# EAGLE design camera_board (EAGLE 5.10)
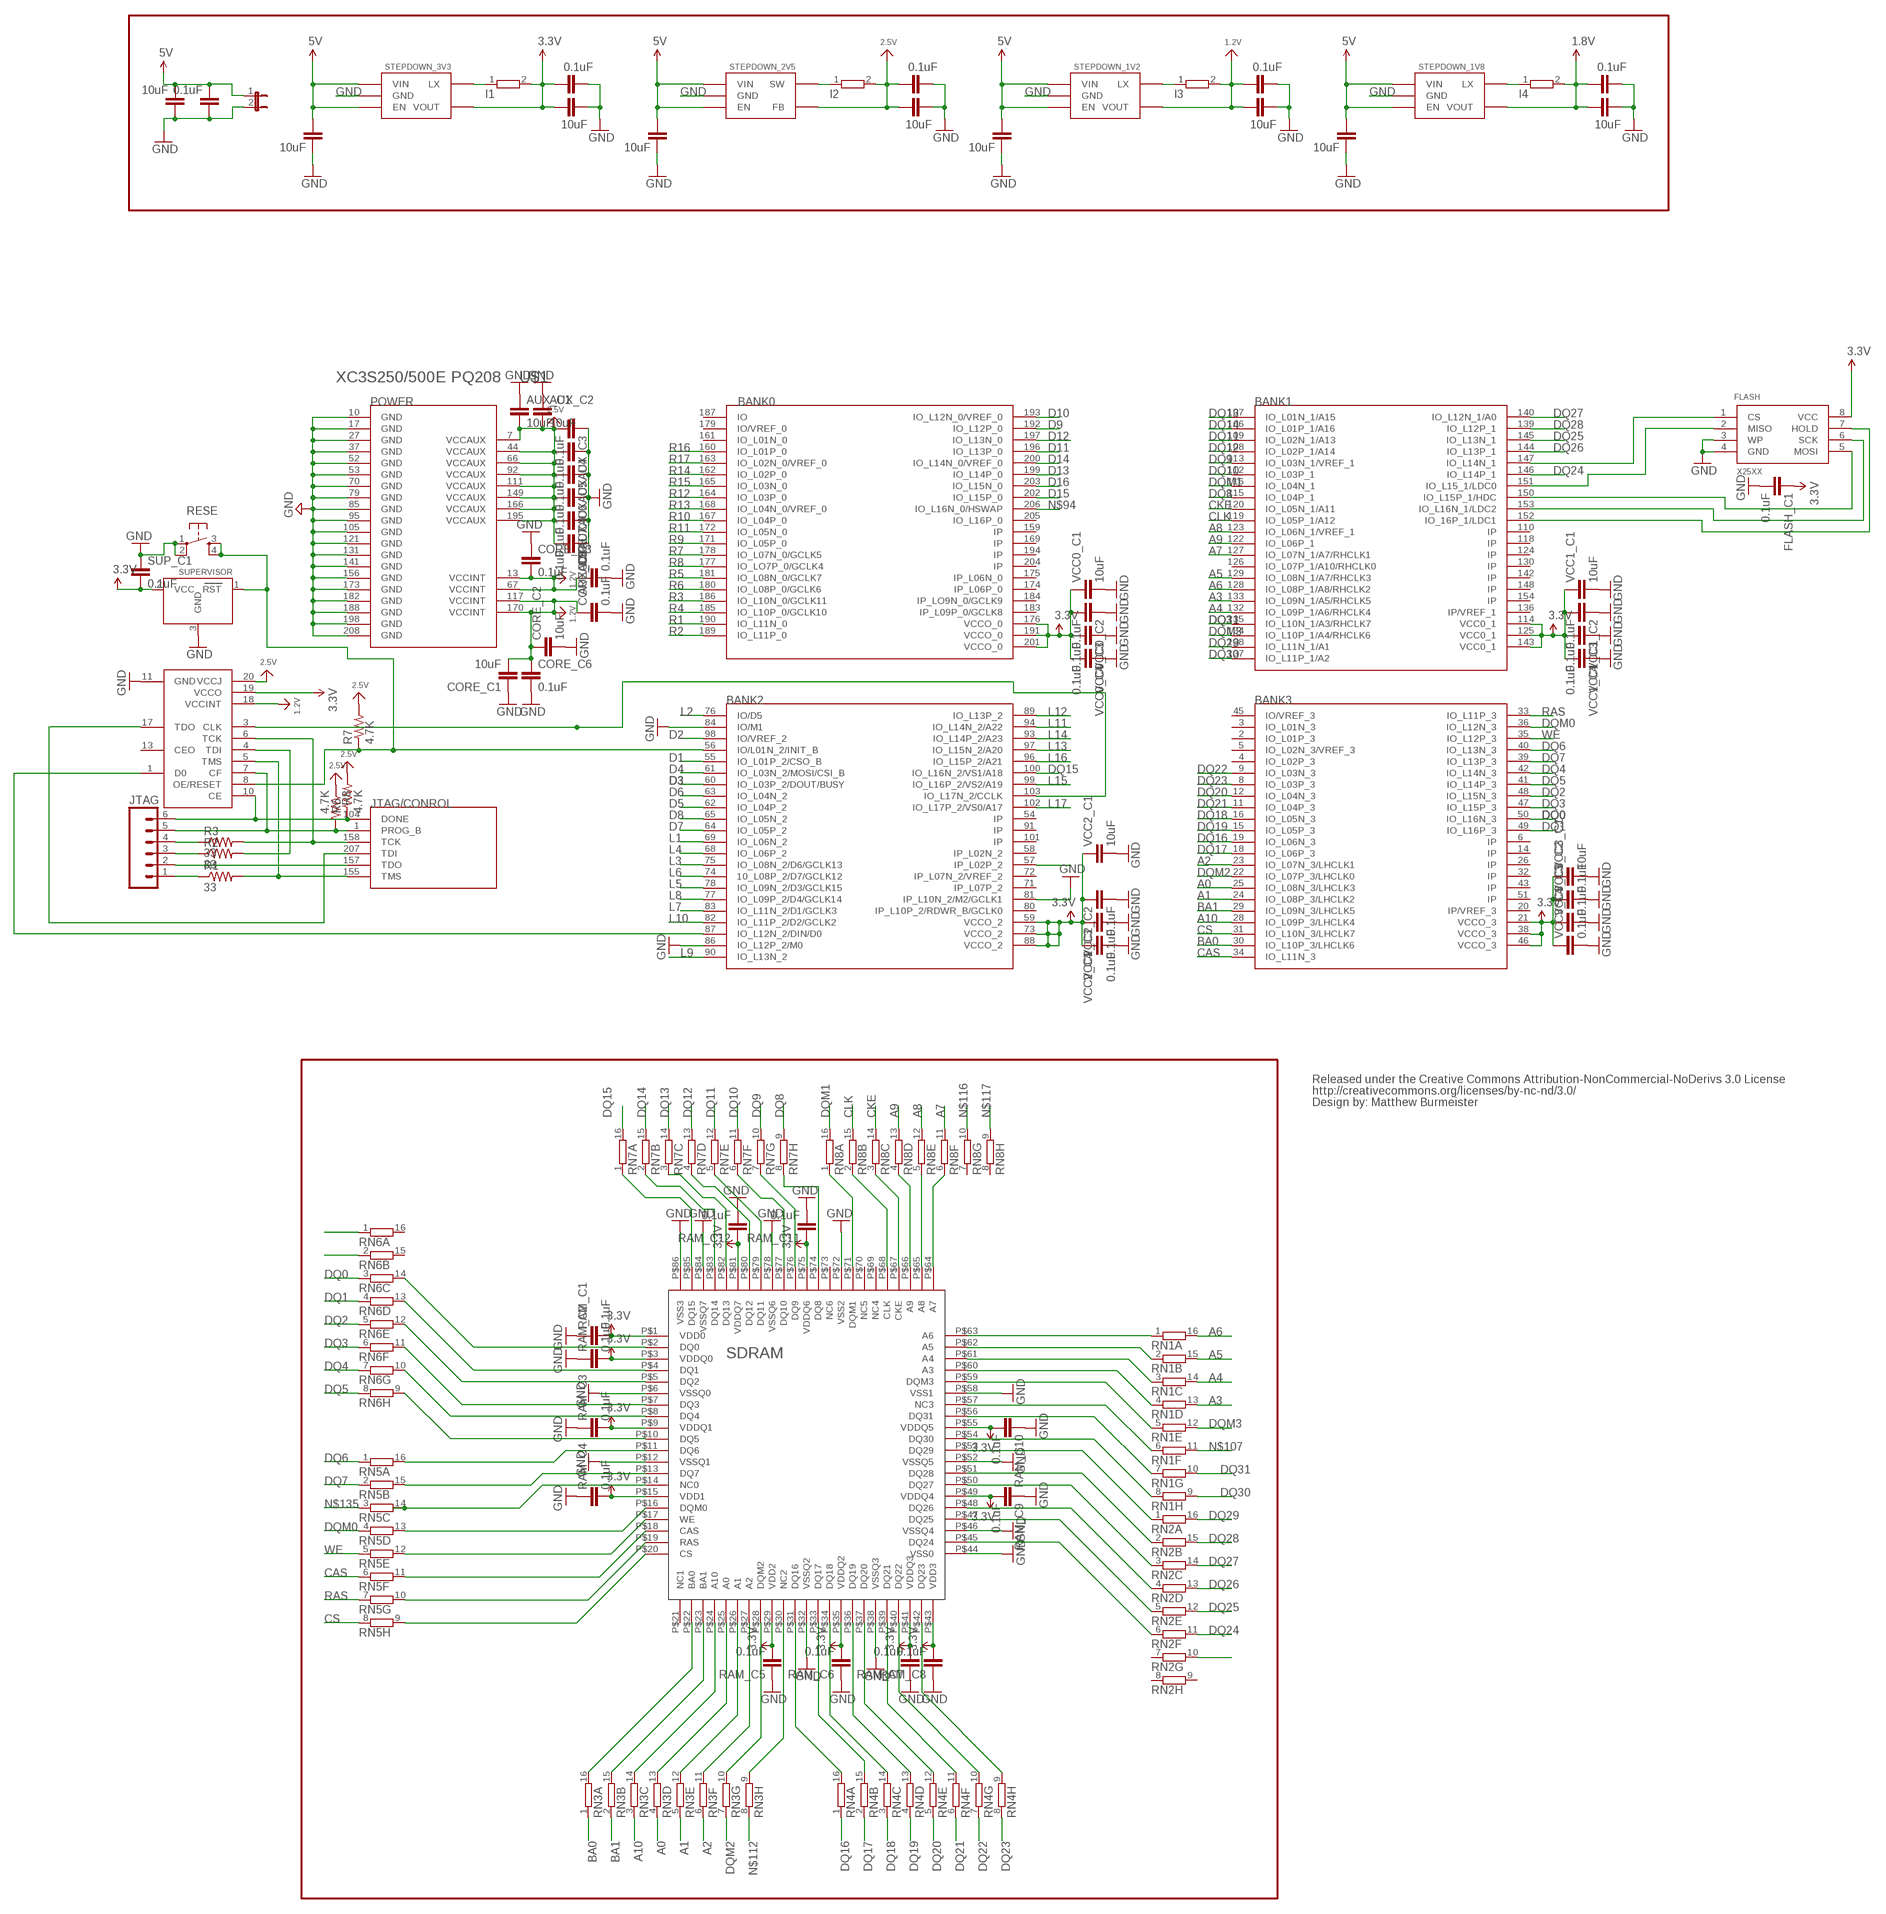
[diagram p0: schematic, sheet 1, part 1 of 2]
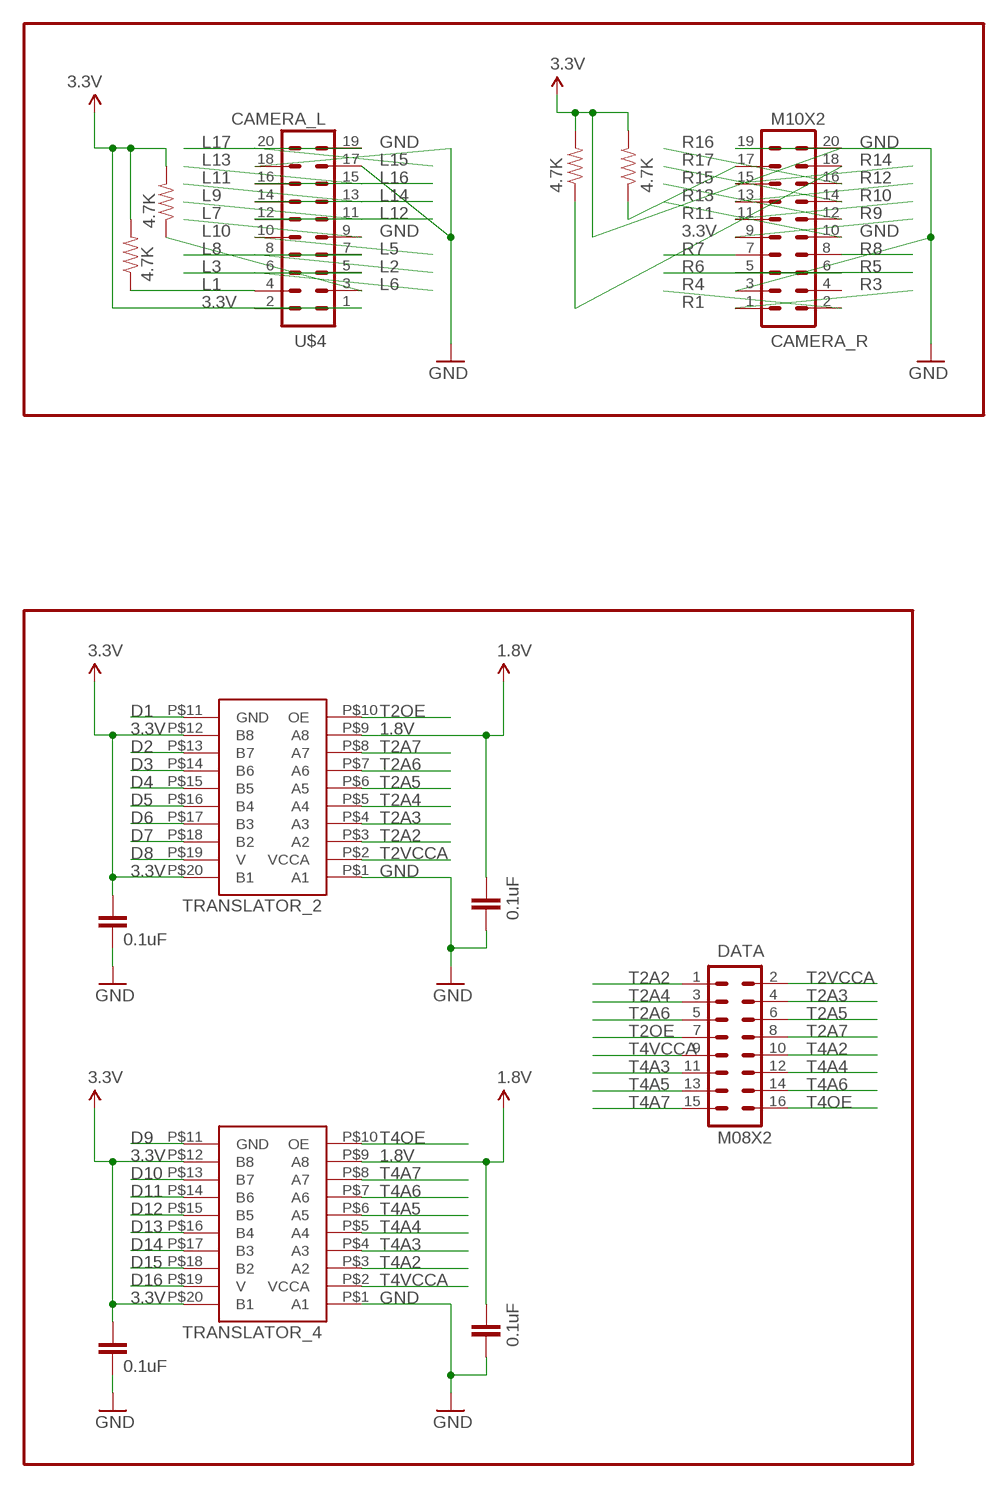
[diagram p1: schematic, sheet 1, part 2 of 2]

## Parts
1V2_C1  10uF  CAP0805  [0805]
1V2_C2  0.1uF  CAP0805  [0805]
1V2_C3  10uF  CAP0805  [0805]
1V8_C1  10uF  CAP0805  [0805]
1V8_C2  0.1uF  CAP0805  [0805]
1V8_C3  10uF  CAP0805  [0805]
2V5_C1  10uF  CAP0805  [0805]
2V5_C2  0.1uF  CAP0805  [0805]
2V5_C3  10uF  CAP0805  [0805]
3V3_C1  10uF  CAP0805  [0805]
3V3_C2  0.1uF  CAP0805  [0805]
3V3_C3  10uF  CAP0805  [0805]
5V  JP1E  [JP1]
5V_C1  10uF  CAP0805  [0805]
5V_C2  0.1uF  CAP0805  [0805]
AUX_C1  10uF  CAP1206  [1206]
AUX_C2  10uF  CAP1206  [1206]
AUX_C3  0.1uF  CAP0805  [0805]
AUX_C4  0.1uF  CAP0805  [0805]
AUX_C5  0.1uF  CAP0805  [0805]
AUX_C6  0.1uF  CAP0805  [0805]
AUX_C7  0.1uF  CAP0805  [0805]
AUX_C8  0.1uF  CAP0805  [0805]
CAMERA_R  M10X2  [2X10]
CORE_C1  10uF  CAP1206  [1206]
CORE_C2  10uF  CAP1206  [1206]
CORE_C3  0.1uF  CAP0805  [0805]
CORE_C4  0.1uF  CAP0805  [0805]
CORE_C5  0.1uF  CAP0805  [0805]
CORE_C6  0.1uF  CAP0805  [0805]
DATA  M08X2  [2X8]
FLASH  X25XX  SPI_FLASH-X25XXSMD1  [SO08-EIAJ]
FLASH_C1  0.1uF  CAP0805  [0805]
I1  AVC_CRI1008  [1008-2]
I2  AVC_CRI1008  [1008-2]
I3  AVC_CRI1008  [1008-2]
I4  AVC_CRI1008  [1008-2]
INFO1  CC_MATTTHEGEEKAVC  [CC_MATTTHEGEEK]
JTAG  M06SIP  [1X06]
PROM  XCF02STSSOP  [TSSOP20]
R1  33  RESISTOR0402-RES  [0402-RES]
R2  33  RESISTOR0402-RES  [0402-RES]
R3  33  RESISTOR0402-RES  [0402-RES]
R6  4.7K  RESISTOR0402-RES  [0402-RES]
R7  4.7K  RESISTOR0402-RES  [0402-RES]
R8  4.7K  RESISTOR0402-RES  [0402-RES]
R9  4.7K  RESISTOR0402-RES  [0402-RES]
R10  4.7K  RESISTOR0402-RES  [0402-RES]
R11  4.7K  RESISTOR0402-RES  [0402-RES]
R12  4.7K  RESISTOR0402-RES  [0402-RES]
RAM_C1  0.1uF  CAP0805  [0805]
RAM_C2  0.1uF  CAP0805  [0805]
RAM_C3  0.1uF  CAP0805  [0805]
RAM_C4  0.1uF  CAP0805  [0805]
RAM_C5  0.1uF  CAP0805  [0805]
RAM_C6  0.1uF  CAP0805  [0805]
RAM_C7  0.1uF  CAP0805  [0805]
RAM_C8  0.1uF  CAP0805  [0805]
RAM_C9  0.1uF  CAP0805  [0805]
RAM_C10  0.1uF  CAP0805  [0805]
RAM_C11  0.1uF  CAP0805  [0805]
RAM_C12  0.1uF  CAP0805  [0805]
RESE  TAC_SWITCHSMD  [TACTILE_SWITCH_SMD]
RN1  AVC_8R-NEXB2HV  [EXB2HV]
RN2  AVC_8R-NEXB2HV  [EXB2HV]
RN3  AVC_8R-NEXB2HV  [EXB2HV]
RN4  AVC_8R-NEXB2HV  [EXB2HV]
RN5  AVC_8R-NEXB2HV  [EXB2HV]
RN6  AVC_8R-NEXB2HV  [EXB2HV]
RN7  AVC_8R-NEXB2HV  [EXB2HV]
RN8  AVC_8R-NEXB2HV  [EXB2HV]
SDRAM  AVC_512KSDRAM  [TSOPII86]
STEPDOWN_1V2  AVC_HIGHPOWERREGSOT  [SOT23-5]
STEPDOWN_1V8  AVC_HIGHPOWERREGSOT  [SOT23-5]
STEPDOWN_2V5  AVC_LOWPOWERREGSOT  [SOT23-5]
STEPDOWN_3V3  AVC_HIGHPOWERREGSOT  [SOT23-5]
SUP_C1  0.1uF  CAP0805  [0805]
SUPERVISOR  MCP130TWAVE  [SOT23-W]
TRANS_C1  0.1uF  CAP0805  [0805]
TRANS_C2  0.1uF  CAP0805  [0805]
TRANS_C4  0.1uF  CAP0805  [0805]
TRANSC3  0.1uF  CAP0805  [0805]
TRANSLATOR_2  AVC_BITRANSLATORTSSOP  [TSSOP20]
TRANSLATOR_4  AVC_BITRANSLATORTSSOP  [TSSOP20]
U$1  XC3S250/500E-PQ208  [PQ208]
U$4  CAMERA_L  M10X2  [2X10]
VCC0_C1  10uF  CAP1206  [1206]
VCC0_C2  0.1uF  CAP0805  [0805]
VCC0_C3  0.1uF  CAP0805  [0805]
VCC0_C4  0.1uF  CAP0805  [0805]
VCC1_C1  10uF  CAP1206  [1206]
VCC1_C2  0.1uF  CAP0805  [0805]
VCC1_C3  0.1uF  CAP0805  [0805]
VCC1_C4  0.1uF  CAP0805  [0805]
VCC2_C1  10uF  CAP1206  [1206]
VCC2_C2  0.1uF  CAP0805  [0805]
VCC2_C3  0.1uF  CAP0805  [0805]
VCC2_C4  0.1uF  CAP0805  [0805]
VCC3_C1  10uF  CAP1206  [1206]
VCC3_C2  0.1uF  CAP0805  [0805]
VCC3_C3  0.1uF  CAP0805  [0805]
VCC3_C4  0.1uF  CAP0805  [0805]

## Nets
1.2V: 1V2_C2.2 1V2_C3.1 CORE_C1.2 CORE_C2.1 CORE_C3.2 CORE_C4.1 CORE_C5.1 CORE_C6.1 I3.2 PROM.18(VCCINT) STEPDOWN_1V2.4(VOUT) U$1.13(VCCINT) U$1.67(VCCINT) U$1.117(VCCINT) U$1.170(VCCINT)
1.8V: 1V8_C2.2 1V8_C3.1 I4.2 STEPDOWN_1V8.4(VOUT) TRANS_C2.1 TRANS_C4.1 TRANSLATOR_2.P$9(A8) TRANSLATOR_4.P$9(A8)
2.5V: 2V5_C2.2 2V5_C3.1 AUX_C1.2 AUX_C2.2 AUX_C3.2 AUX_C4.2 AUX_C5.2 AUX_C6.2 AUX_C7.2 AUX_C8.2 I2.2 PROM.20(VCCJ) R6.2 R7.2 R8.1 STEPDOWN_2V5.4(FB) U$1.7(VCCAUX) U$1.44(VCCAUX) U$1.66(VCCAUX) U$1.92(VCCAUX) U$1.111(VCCAUX) U$1.149(VCCAUX) U$1.166(VCCAUX) U$1.195(VCCAUX)
3.3V: 3V3_C2.2 3V3_C3.1 CAMERA_R.20 FLASH.8(VCC) FLASH_C1.1 I1.2 PROM.19(VCCO) R9.2 R10.2 R11.2 R12.2 RAM_C1.2 RAM_C2.2 RAM_C3.2 RAM_C4.2 RAM_C5.2 RAM_C6.2 RAM_C7.2 RAM_C8.2 RAM_C9.2 RAM_C10.2 RAM_C11.1 RAM_C12.1 SDRAM.P$1(VDD0) SDRAM.P$3(VDDQ0) SDRAM.P$9(VDDQ1) SDRAM.P$15(VDD1) SDRAM.P$29(VDD2) SDRAM.P$35(VDDQ2) SDRAM.P$41(VDDQ3) SDRAM.P$43(VDD3) SDRAM.P$49(VDDQ4) SDRAM.P$55(VDDQ5) SDRAM.P$75(VDDQ6) SDRAM.P$81(VDDQ7) STEPDOWN_3V3.4(VOUT) SUP_C1.2 SUPERVISOR.2(VCC) TRANS_C1.1 TRANSC3.1 TRANSLATOR_2.P$12(B8) TRANSLATOR_2.P$20(B1) TRANSLATOR_4.P$12(B8) TRANSLATOR_4.P$20(B1) U$1.21(VCCO_3) U$1.38(VCCO_3) U$1.46(VCCO_3) U$1.59(VCCO_2) U$1.73(VCCO_2) U$1.88(VCCO_2) U$1.114(VCC0_1) U$1.125(VCC0_1) U$1.143(VCC0_1) U$1.176(VCCO_0) U$1.191(VCCO_0) U$1.201(VCCO_0) U$4.1 VCC0_C1.1 VCC0_C2.2 VCC0_C3.2 VCC0_C4.2 VCC1_C1.1 VCC1_C2.2 VCC1_C3.2 VCC1_C4.2 VCC2_C1.1 VCC2_C2.1 VCC2_C3.1 VCC2_C4.1 VCC3_C1.1 VCC3_C2.1 VCC3_C3.1 VCC3_C4.1
5V: 1V2_C1.2 1V8_C1.2 2V5_C1.2 3V3_C1.2 5V.1 5V_C1.2 5V_C2.2 STEPDOWN_1V2.1(VIN) STEPDOWN_1V2.3(EN) STEPDOWN_1V8.1(VIN) STEPDOWN_1V8.3(EN) STEPDOWN_2V5.1(VIN) STEPDOWN_2V5.3(EN) STEPDOWN_3V3.1(VIN) STEPDOWN_3V3.3(EN)
A0: RN3.4 U$1.25(IO_L08N_3/LHCLK3)
A1: RN3.5 U$1.24(IO_L08P_3/LHCLK2)
A2: RN3.6 U$1.23(IO_L07N_3/LHCLK1)
A3: RN1.13 U$1.133(IO_L09N_1/A5/RHCLK5)
A4: RN1.14 U$1.132(IO_L09P_1/A6/RHCLK4)
A5: RN1.15 U$1.129(IO_L08N_1/A7/RHCLK3)
A6: RN1.16 U$1.128(IO_L08P_1/A8/RHCLK2)
A7: RN8.11 U$1.127(IO_L07N_1/A7/RHCLK1)
A8: RN8.12 U$1.123(IO_L06N_1/VREF_1)
A9: RN8.13 U$1.122(IO_L06P_1)
A10: RN3.3 U$1.28(IO_L09P_3/LHCLK4)
BA0: RN3.1 U$1.30(IO_L10P_3/LHCLK6)
BA1: RN3.2 U$1.29(IO_L09N_3/LHCLK5)
CAS: RN5.6 U$1.34(IO_L11N_3)
CKE: RN8.14 U$1.120(IO_L05N_1/A11)
CLK: RN8.15 U$1.119(IO_L05P_1/A12)
CS: RN5.8 U$1.31(IO_L10N_3/LHCLK7)
D1: TRANSLATOR_2.P$11(GND) U$1.55(IO_L01P_2/CSO_B)
D2: TRANSLATOR_2.P$13(B7) U$1.98(IO/VREF_2)
D3: TRANSLATOR_2.P$14(B6) U$1.60(IO_L03P_2/DOUT/BUSY)
D4: TRANSLATOR_2.P$15(B5) U$1.61(IO_L03N_2/MOSI/CSI_B)
D5: TRANSLATOR_2.P$16(B4) U$1.62(IO_L04P_2)
D6: TRANSLATOR_2.P$17(B3) U$1.63(IO_L04N_2)
D7: TRANSLATOR_2.P$18(B2) U$1.64(IO_L05P_2)
D8: TRANSLATOR_2.P$19(V) U$1.65(IO_L05N_2)
D9: TRANSLATOR_4.P$11(GND) U$1.192(IO_L12P_0)
D10: TRANSLATOR_4.P$13(B7) U$1.193(IO_L12N_0/VREF_0)
D11: TRANSLATOR_4.P$14(B6) U$1.196(IO_L13P_0)
D12: TRANSLATOR_4.P$15(B5) U$1.197(IO_L13N_0)
D13: TRANSLATOR_4.P$16(B4) U$1.199(IO_L14P_0)
D14: TRANSLATOR_4.P$17(B3) U$1.200(IO_L14N_0/VREF_0)
D15: TRANSLATOR_4.P$18(B2) U$1.202(IO_L15P_0)
D16: TRANSLATOR_4.P$19(V) U$1.203(IO_L15N_0)
DQ0: RN6.3 U$1.50(IO_L16N_3)
DQ1: RN6.4 U$1.49(IO_L16P_3)
DQ2: RN6.5 U$1.48(IO_L15N_3)
DQ3: RN6.6 U$1.47(IO_L15P_3)
DQ4: RN6.7 U$1.42(IO_L14N_3)
DQ5: RN6.8 U$1.41(IO_L14P_3)
DQ6: RN5.1 U$1.40(IO_L13N_3)
DQ7: RN5.2 U$1.39(IO_L13P_3)
DQ8: RN7.9 U$1.115(IO_L04P_1)
DQ9: RN7.10 U$1.113(IO_L03N_1/VREF_1)
DQ10: RN7.11 U$1.112(IO_L03P_1)
DQ11: RN7.12 U$1.109(IO_L02N_1/A13)
DQ12: RN7.13 U$1.108(IO_L02P_1/A14)
DQ13: RN7.14 U$1.107(IO_L01N_1/A15)
DQ14: RN7.15 U$1.106(IO_L01P_1/A16)
DQ15: RN7.16 U$1.100(IO_L16N_2/VS1/A18)
DQ16: RN4.1 U$1.19(IO_L06N_3)
DQ17: RN4.2 U$1.18(IO_L06P_3)
DQ18: RN4.3 U$1.16(IO_L05N_3)
DQ19: RN4.4 U$1.15(IO_L05P_3)
DQ20: RN4.5 U$1.12(IO_L04N_3)
DQ21: RN4.6 U$1.11(IO_L04P_3)
DQ22: RN4.7 U$1.9(IO_L03N_3)
DQ23: RN4.8 U$1.8(IO_L03P_3)
DQ24: RN2.11 U$1.146(IO_L14P_1)
DQ25: RN2.12 U$1.145(IO_L13N_1)
DQ26: RN2.13 U$1.144(IO_L13P_1)
DQ27: RN2.14 U$1.140(IO_L12N_1/A0)
DQ28: RN2.15 U$1.139(IO_L12P_1)
DQ29: RN2.16 U$1.138(IO_L11N_1/A1)
DQ30: RN1.9 U$1.137(IO_L11P_1/A2)
DQ31: RN1.10 U$1.135(IO_L10N_1/A3/RHCLK7)
DQM0: RN5.4 U$1.36(IO_L12N_3)
DQM1: RN8.16 U$1.116(IO_L04N_1)
DQM2: RN3.7 U$1.22(IO_L07P_3/LHCLK0)
DQM3: RN1.12 U$1.134(IO_L10P_1/A4/RHCLK6)
GND: 1V2_C1.1 1V2_C2.1 1V2_C3.2 1V8_C1.1 1V8_C2.1 1V8_C3.2 2V5_C1.1 2V5_C2.1 2V5_C3.2 3V3_C1.1 3V3_C2.1 3V3_C3.2 5V.2 5V_C1.1 5V_C2.1 AUX_C1.1 AUX_C2.1 AUX_C3.1 AUX_C4.1 AUX_C5.1 AUX_C6.1 AUX_C7.1 AUX_C8.1 CAMERA_R.3 CAMERA_R.19 CORE_C1.1 CORE_C2.2 CORE_C3.1 CORE_C4.2 CORE_C5.2 CORE_C6.2 FLASH.3(WP) FLASH.4(GND) FLASH_C1.2 PROM.11(GND) RAM_C1.1 RAM_C2.1 RAM_C3.1 RAM_C4.1 RAM_C5.1 RAM_C6.1 RAM_C7.1 RAM_C8.1 RAM_C9.1 RAM_C10.1 RAM_C11.2 RAM_C12.2 RESE.1 RESE.2 SDRAM.P$6(VSSQ0) SDRAM.P$12(VSSQ1) SDRAM.P$32(VSSQ2) SDRAM.P$38(VSSQ3) SDRAM.P$44(VSS0) SDRAM.P$46(VSSQ4) SDRAM.P$52(VSSQ5) SDRAM.P$58(VSS1) SDRAM.P$72(VSS2) SDRAM.P$78(VSSQ6) SDRAM.P$84(VSSQ7) SDRAM.P$86(VSS3) STEPDOWN_1V2.2(GND) STEPDOWN_1V8.2(GND) STEPDOWN_2V5.2(GND) STEPDOWN_3V3.2(GND) SUP_C1.1 SUPERVISOR.3(GND) TRANS_C1.2 TRANS_C2.2 TRANS_C4.2 TRANSC3.2 TRANSLATOR_2.P$1(A1) TRANSLATOR_4.P$1(A1) U$1.10(GND) U$1.17(GND) U$1.27(GND) U$1.37(GND) U$1.52(GND) U$1.53(GND) U$1.70(GND) U$1.79(GND) U$1.81(IP_L10N_2/M2/GCLK1) U$1.84(IO/M1) U$1.85(GND) U$1.86(IO_L12P_2/M0) U$1.95(GND) U$1.105(GND) U$1.121(GND) U$1.131(GND) U$1.141(GND) U$1.156(GND) U$1.173(GND) U$1.182(GND) U$1.188(GND) U$1.198(GND) U$1.208(GND) U$4.17 U$4.18 VCC0_C1.2 VCC0_C2.1 VCC0_C3.1 VCC0_C4.1 VCC1_C1.2 VCC1_C2.1 VCC1_C3.1 VCC1_C4.1 VCC2_C1.2 VCC2_C2.2 VCC2_C3.2 VCC2_C4.2 VCC3_C1.2 VCC3_C2.2 VCC3_C3.2 VCC3_C4.2
L1: R9.1 U$1.69(IO_L06N_2) U$4.4
L2: U$1.76(IO/D5) U$4.8
L3: U$1.75(IO_L08N_2/D6/GCLK13) U$4.5
L4: U$1.68(IO_L06P_2)
L5: U$1.78(IO_L09N_2/D3/GCLK15) U$4.10
L6: U$1.74(10_L08P_2/D7/GCLK12) U$4.6
L7: U$1.83(IO_L11N_2/D1/GCLK3) U$4.9
L8: U$1.77(IO_L09P_2/D4/GCLK14) U$4.7
L9: U$1.90(IO_L13N_2) U$4.11
L10: R10.1 U$1.82(IO_L11P_2/D2/GCLK2) U$4.3
L11: U$1.94(IO_L14N_2/A22) U$4.13
L12: U$1.89(IO_L13P_2) U$4.12
L13: U$1.97(IO_L15N_2/A20) U$4.15
L14: U$1.57(IP_L02P_2) U$1.93(IO_L14P_2/A23) U$4.14
L15: U$1.99(IO_L16P_2/VS2/A19) U$4.20
L16: U$1.96(IO_L15P_2/A21) U$4.16
L17: U$1.102(IO_L17P_2/VS0/A17) U$4.19
N$1: JTAG.1 R1.1
N$2: RN1.1 SDRAM.P$63(A6)
N$3: JTAG.3 R2.1
N$4: RN1.2 SDRAM.P$62(A5)
N$7: RN1.3 SDRAM.P$61(A4)
N$8: RN1.4 SDRAM.P$60(A3)
N$9: RN1.5 SDRAM.P$59(DQM3)
N$10: RN1.6 SDRAM.P$57(NC3)
N$11: RN1.7 SDRAM.P$56(DQ31)
N$12: RN1.8 SDRAM.P$54(DQ30)
N$13: RN2.1 SDRAM.P$53(DQ29)
N$14: RN2.2 SDRAM.P$51(DQ28)
N$15: RN2.3 SDRAM.P$50(DQ27)
N$16: RN2.4 SDRAM.P$48(DQ26)
N$17: RN2.5 SDRAM.P$47(DQ25)
N$18: RN2.6 SDRAM.P$45(DQ24)
N$19: RN3.16 SDRAM.P$22(BA0)
N$20: RN3.15 SDRAM.P$23(BA1)
N$21: RN3.14 SDRAM.P$24(A10)
N$22: RN3.13 SDRAM.P$25(A0)
N$23: RN3.12 SDRAM.P$26(A1)
N$24: RN3.10 SDRAM.P$28(DQM2)
N$25: RN3.11 SDRAM.P$27(A2)
N$26: RN3.9 SDRAM.P$30(NC2)
N$27: RN4.16 SDRAM.P$31(DQ16)
N$28: RN4.15 SDRAM.P$33(DQ17)
N$29: RN4.14 SDRAM.P$34(DQ18)
N$32: RN4.13 SDRAM.P$36(DQ19)
N$33: RN4.12 SDRAM.P$37(DQ20)
N$34: PROM.1(D0) U$1.87(IO_L12N_2/DIN/D0)
N$35: PROM.8(OE/RESET) R7.1 RESE.3 RESE.4 SUPERVISOR.1(RST) U$1.56(IO/L01N_2/INIT_B)
N$36: FLASH.1(CS) U$1.147(IO_L14N_1)
N$37: FLASH.2(MISO) U$1.151(IO_L15_1/LDC0)
N$38: FLASH.5(MOSI) U$1.150(IO_L15P_1/HDC)
N$39: RN4.11 SDRAM.P$39(DQ21)
N$40: RN4.10 SDRAM.P$40(DQ22)
N$41: RN5.9 SDRAM.P$20(CS)
N$42: RN5.10 SDRAM.P$19(RAS)
N$43: RN5.11 SDRAM.P$18(CAS)
N$44: RN5.12 SDRAM.P$17(WE)
N$45: RN5.13 SDRAM.P$16(DQM0)
N$46: RN5.14 SDRAM.P$14(NC0)
N$47: RN5.15 SDRAM.P$13(DQ7)
N$48: RN5.16 SDRAM.P$11(DQ6)
N$49: RN6.9 SDRAM.P$10(DQ5)
N$50: RN6.10 SDRAM.P$8(DQ4)
N$51: RN6.11 SDRAM.P$7(DQ3)
N$52: RN6.12 SDRAM.P$5(DQ2)
N$53: RN6.13 SDRAM.P$4(DQ1)
N$54: RN6.14 SDRAM.P$2(DQ0)
N$55: RN7.1 SDRAM.P$85(DQ15)
N$56: RN7.2 SDRAM.P$83(DQ14)
N$57: RN7.3 SDRAM.P$82(DQ13)
N$58: RN7.4 SDRAM.P$80(DQ12)
N$59: RN7.5 SDRAM.P$79(DQ11)
N$60: RN7.6 SDRAM.P$77(DQ10)
N$61: RN7.7 SDRAM.P$76(DQ9)
N$62: RN7.8 SDRAM.P$74(DQ8)
N$63: RN8.1 SDRAM.P$71(DQM1)
N$64: RN8.2 SDRAM.P$68(CLK)
N$65: RN8.3 SDRAM.P$67(CKE)
N$66: RN8.4 SDRAM.P$66(A9)
N$67: FLASH.6(SCK) U$1.153(IO_L16N_1/LDC2)
N$68: FLASH.7(HOLD) U$1.152(IO_16P_1/LDC1)
N$69: JTAG.4 R3.1
N$70: PROM.3(CLK) U$1.103(IO_L17N_2/CCLK)
N$71: I4.1 STEPDOWN_1V8.5(LX)
N$73: I2.1 STEPDOWN_2V5.5(SW)
N$74: I1.1 STEPDOWN_3V3.5(LX)
N$75: I3.1 STEPDOWN_1V2.5(LX)
N$94: U$1.206(IO_L16N_0/HSWAP)
N$95: RN8.5 SDRAM.P$65(A8)
N$101: RN8.6 SDRAM.P$64(A7)
N$102: RN4.9 SDRAM.P$42(DQ23)
N$107: RN1.11
N$112: RN3.8
N$116: RN8.10
N$117: RN8.9
N$118: RN2.10
N$122: PROM.5(TMS) R1.2 U$1.155(TMS)
N$123: JTAG.2 U$1.157(TDO)
N$124: PROM.4(TDI) R2.2
N$125: PROM.6(TCK) R3.2 U$1.158(TCK)
N$126: JTAG.5 PROM.7(CF) R8.2 U$1.1(PROG_B)
N$127: JTAG.6 PROM.10(CE) R6.1 U$1.104(DONE)
N$135: RN5.3
N$144: RN6.2
N$145: RN6.1
N$175: PROM.17(TDO) U$1.207(TDI)
R1: CAMERA_R.18 R11.1 U$1.190(IO_L11N_0)
R2: U$1.189(IO_L11P_0)
R3: CAMERA_R.1 U$1.186(IO_L10N_0/GCLK11)
R4: CAMERA_R.2 U$1.185(IO_L10P_0/GCLK10)
R5: CAMERA_R.5 U$1.181(IO_L08N_0/GCLK7)
R6: CAMERA_R.6 U$1.180(IO_L08P_0/GCLK6)
R7: CAMERA_R.7 U$1.178(IO_L07N_0/GCLK5)
R8: CAMERA_R.8 U$1.177(IO_LO7P_0/GCLK4)
R9: CAMERA_R.9 U$1.171(IO_L05P_0)
R10: CAMERA_R.11 U$1.167(IO_L04P_0)
R11: CAMERA_R.17 R12.1 U$1.172(IO_L05N_0)
R12: CAMERA_R.13 U$1.164(IO_L03P_0)
R13: CAMERA_R.10 U$1.168(IO_L04N_0/VREF_0)
R14: CAMERA_R.15 U$1.162(IO_L02P_0)
R15: CAMERA_R.12 U$1.165(IO_L03N_0)
R16: CAMERA_R.16 U$1.160(IO_L01P_0)
R17: CAMERA_R.14 U$1.163(IO_L02N_0/VREF_0)
RAS: RN5.7 U$1.33(IO_L11P_3)
T2A2: DATA.1 TRANSLATOR_2.P$3(A2)
T2A3: DATA.4 TRANSLATOR_2.P$4(A3)
T2A4: DATA.3 TRANSLATOR_2.P$5(A4)
T2A5: DATA.6 TRANSLATOR_2.P$6(A5)
T2A6: DATA.5 TRANSLATOR_2.P$7(A6)
T2A7: DATA.8 TRANSLATOR_2.P$8(A7)
T2OE: DATA.7 TRANSLATOR_2.P$10(OE)
T2VCCA: DATA.2 TRANSLATOR_2.P$2(VCCA)
T4A2: DATA.10 TRANSLATOR_4.P$3(A2)
T4A3: DATA.11 TRANSLATOR_4.P$4(A3)
T4A4: DATA.12 TRANSLATOR_4.P$5(A4)
T4A5: DATA.13 TRANSLATOR_4.P$6(A5)
T4A6: DATA.14 TRANSLATOR_4.P$7(A6)
T4A7: DATA.15 TRANSLATOR_4.P$8(A7)
T4OE: DATA.16 TRANSLATOR_4.P$10(OE)
T4VCCA: DATA.9 TRANSLATOR_4.P$2(VCCA)
WE: RN5.5 U$1.35(IO_L12P_3)
Unconnected: CAMERA_R.4 PROM.13(CEO) RN2.7 RN2.8 RN2.9 RN6.15 RN6.16 RN8.7 RN8.8 SDRAM.P$21(NC1) SDRAM.P$69(NC4) SDRAM.P$70(NC5) SDRAM.P$73(NC6) U$1.2(IO_L01P_3) U$1.3(IO_L01N_3) U$1.4(IO_L02P_3) U$1.5(IO_L02N_3/VREF_3) U$1.6(IP) U$1.14(IP) U$1.20(IP/VREF_3) U$1.26(IP) U$1.32(IP) U$1.43(IP) U$1.45(IO/VREF_3) U$1.51(IP) U$1.54(IP) U$1.58(IP_L02N_2) U$1.71(IP_L07P_2) U$1.72(IP_L07N_2/VREF_2) U$1.80(IP_L10P_2/RDWR_B/GCLK0) U$1.91(IP) U$1.101(IP) U$1.110(IP) U$1.118(IP) U$1.124(IP) U$1.126(IO_L07P_1/A10/RHCLK0) U$1.130(IP) U$1.136(IP/VREF_1) U$1.142(IP) U$1.148(IP) U$1.154(IP) U$1.159(IP) U$1.161(IO_L01N_0) U$1.169(IP) U$1.174(IP_L06P_0) U$1.175(IP_L06N_0) U$1.179(IO/VREF_0) U$1.183(IP_L09P_0/GCLK8) U$1.184(IP_LO9N_0/GCLK9) U$1.187(IO) U$1.194(IP) U$1.204(IP) U$1.205(IO_L16P_0) U$4.2

## Library data of the parts
1V2_C1-1V2_C3 1V8_C1-1V8_C3 2V5_C1-2V5_C3 3V3_C1-3V3_C3 5V_C1 5V_C2 AUX_C1-AUX_C8 CORE_C1-CORE_C6 FLASH_C1 RAM_C1-RAM_C12 SUP_C1 TRANS_C1 TRANS_C2 TRANS_C4 TRANSC3 VCC0_C1-VCC0_C4 VCC1_C1-VCC1_C4 VCC2_C1-VCC2_C4 VCC3_C1-VCC3_C4 = SparkFun:CAP: Capacitor Standard 0603 ceramic capacitor, and 0.1" leaded capacitor.
5V = jumper:JP1E: JUMPER
CAMERA_R U$4 = SparkFun:M10X2: This was SPECIALLY designed to be used with our Graphic LCD Backpack. Be sure you want to use this! It is not only staggered on each line of header holes, but IT IS ALSO offset of the center point of the top and bottom lines by 5 mil. This causes the headers to lock into place on the "standard" footprint on the LCD screen. The extra squares on the tdocu layer are there simply to reference other pins (if you were to actually populate a longer header than ten long - this is what we do with the backpacks).
DATA = SparkFun:M08X2
FLASH = SparkFun:SPI_FLASH-X25XX: 8pin SPI Flash series x25xx. Works with devices like W25X32 and BR25L32
I1-I4 = AVC (5):AVC_CRI: Package: 1008 (2520 Metric) <http://search.digikey.com/scripts/DkSearch/dksus.dll?Detail&name=490-5112-1-ND> Compatible with surface mount capacitors, resistors, and inductors. Designed by Evan Teitelman (Paradoxial) for AVC Team Graviton 2011 <http://teamgraviton.com/>.
INFO1 = AVC:CC_MATTTHEGEEK: Creative Commons Nick: MattTheGeek Name: Matthew Burmeister
JTAG = SparkFun:M06: Header 6 Standard 6-pin 0.1" header. Use with straight break away headers (SKU : PRT-00116), right angle break away headers (PRT-00553), swiss pins (PRT-00743), machine pins (PRT-00117), and female headers (PRT-00115). Molex polarized connector foot print use with SKU : PRT-08094 with associated crimp pins and housings. NOTES ON THE VARIANTS LOCK and LOCK_LONGPADS... This footprint was designed to help hold the alignment of a through-hole component (i.e. 6-pin header) while soldering it into place. You may notice that each hole has been shifted either up or down by 0.005 of an inch from it's more standard position (which is a perfectly straight line). This slight alteration caused the pins (the squares in the middle) to touch the edges of the holes. Because they are alternating, it causes a "brace" to hold the component in place. 0.005 has proven to be the perfect amount of "off-center" position when using our standard breakaway headers. Although looks a little odd when you look at the bare footprint, once you have a header in there, the alteration is very hard to notice. Also, if you push a header all the way into place, it is covered up entirely on the bottom side. This idea of altering the position of holes to aid alignment will be further integrated into the Sparkfun Library for other footprints. It can help hold any component with 3 or more connection pins.
PROM = SparkFun:XCF02S
R1-R3 R6-R12 = SparkFun:RESISTOR: Resistor Basic schematic elements and footprints for 0603, 1206, and PTH resistors.
RESE = SparkFun:TAC_SWITCH: Momentary Switch Button commonly used for reset or general input. Spark Fun Electronics SKU : COM-00097
RN1-RN8 = AVC:AVC_8R-N: Part Number: YC248-JR-0733RL <http://search.digikey.com/scripts/DkSearch/dksus.dll?Detail&name=YC248J-33CT-ND>; OC_FARNELL: unknown; OC_NEWARK: unknown
SDRAM = AVC (4):AVC_512KSDRAM: Part Number: IS42S32200E-7TL <http://search.digikey.com/scripts/DkSearch/dksus.dll?Detail&name=706-1081-ND> Designed by Evan Teitelman (Paradoxial) for AVC Team Graviton 2011 <http://teamgraviton.com/>.
STEPDOWN_1V2 STEPDOWN_1V8 STEPDOWN_3V3 = AVC (3):AVC_HIGHPOWERREG: Part Numbers: SC189CSKTRT <http://search.digikey.com/scripts/DkSearch/dksus.dll?Detail&name=SC189CSKCT-ND> and SC189ZSKTRT <http://search.digikey.com/scripts/DkSearch/dksus.dll?Detail&name=SC189ZSKCT-ND> Designed by Evan Teitelman (Paradoxial) for AVC Team Graviton 2011 <http://teamgraviton.com/>.
STEPDOWN_2V5 = AVC (3):AVC_LOWPOWERREG: Part Number: ADP2108AUJZ-2.5-R7 <http://search.digikey.com/scripts/DkSearch/dksus.dll?Detail&name=ADP2108AUJZ-2.5-R7CT-ND> Designed by Evan Teitelman (Paradoxial) for AVC Team Graviton 2011 <http://teamgraviton.com/>.
SUPERVISOR = microbuilder:MCP130T: MCP130T Voltage Supervisor (Active Low) Voltage supervisors will put the MCU in a reset state if the voltage drops below a pre-determined level. SOT23-R/SOT23-W: Voltage Supervisor - 3.15V Active Low Note: Use the "Reflow" footprint when working with solder paste, and the "Wave" footprint when soldering by hand with a soldering iron (the latter has larger pads that are easier to solder by hand). Digikey: MCP130T-315I/TTCT-ND
TRANSLATOR_2 TRANSLATOR_4 = AVC (4):AVC_BITRANSLATOR: Part Number: TXS0108EPWR <http://search.digikey.com/scripts/DkSearch/dksus.dll?Detail&name=296-23011-1-ND> Designed by Evan Teitelman (Paradoxial) for AVC Team Graviton 2011 <http://teamgraviton.com/>.
U$1 = SparkFun:XC3S250/500E-PQ208

## Net classes
0 default: width 0.178 mm, drill 0.381 mm, clearance 0.178 mm
1 Power: width 0.813 mm, drill 0.381 mm, clearance 0.178 mm

## Board
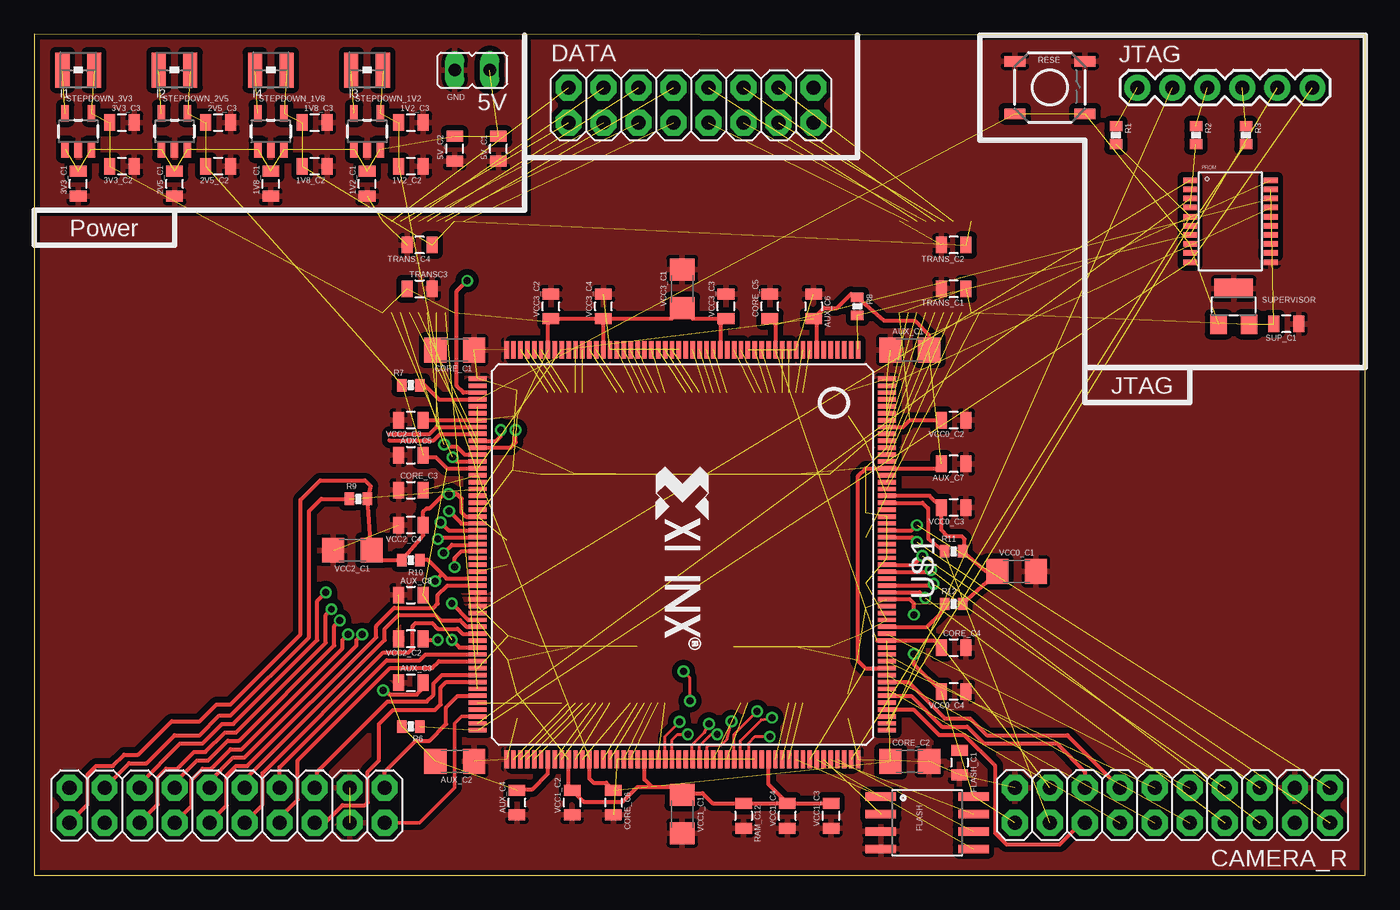
[diagram p2: board, top side]
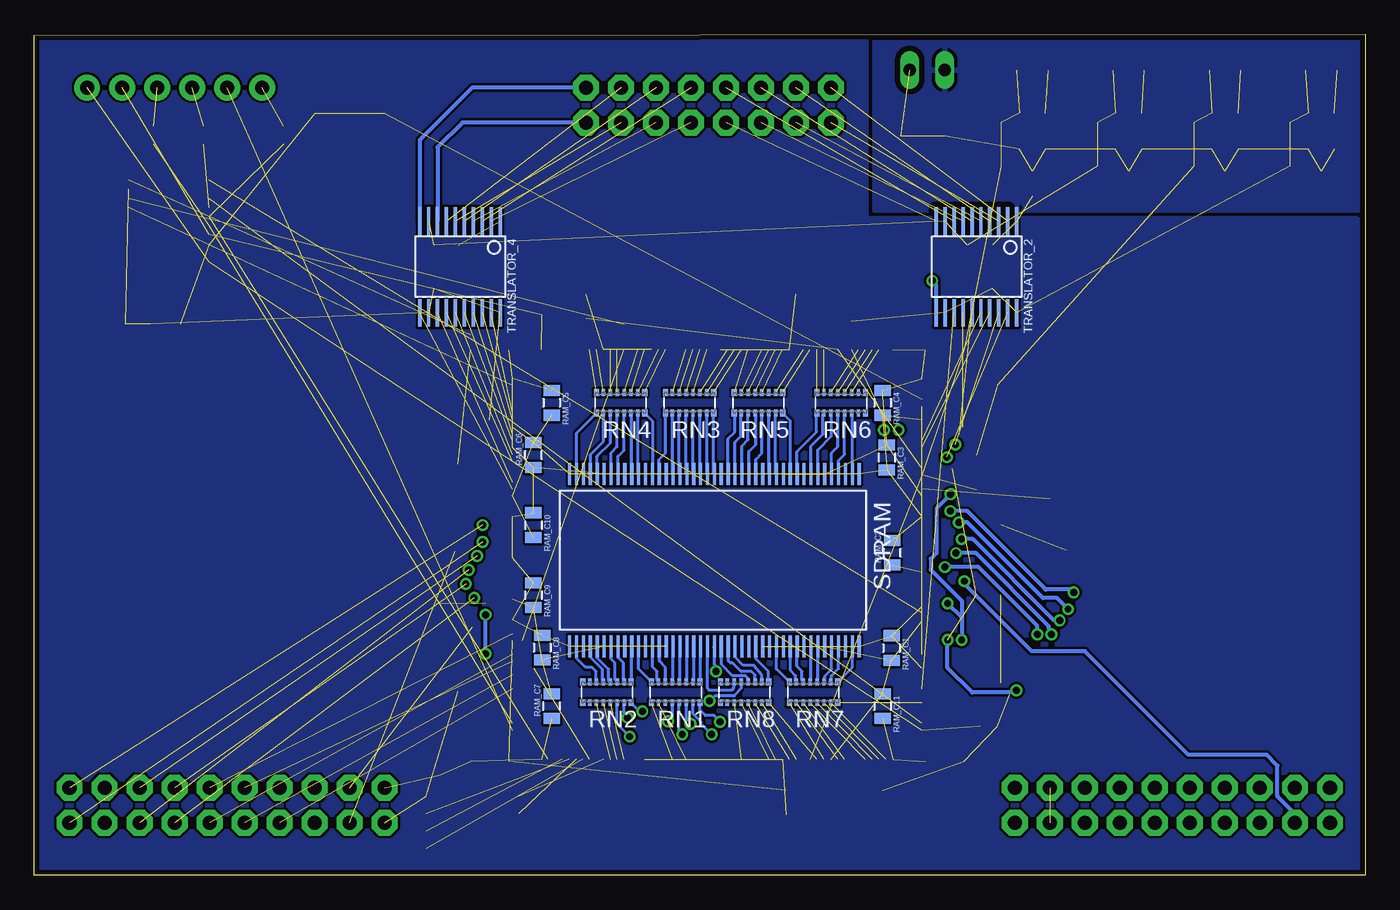
[diagram p3: board, bottom side, seen from below]

Size 96.52 x 61 mm. Coordinates in mm from the lower left corner, seen from the top.
Outline: 0,0 96.52,0 96.52,60.96 0,61 0,0
Copper layers (1*16): Top 0.0356mm / dielectric 1.5011mm / Bottom 0.0356mm
Design rules "LaenPCBOrder": minimum track width 6mil, minimum drill 13mil, track to track 6mil, track to pad 6mil, pad to pad 6mil, via to via 6mil, smd to smd 6mil, copper to edge 15mil, drill to drill 6mil, minimum pad ring 7mil, minimum via ring 7mil, stop-mask expansion 4mil, vias tented up to drill 0mil, thermal gap 10mil

### Footprints (pad centres in the part's own frame; a part is rotated, then mirrored left to right if it is on the bottom)
0805 = smd 0.8 x 1.2: 1 -0.9,0; 2 0.9,0
JP1 = drill 0.914 long: 1 0,-1.27; 2 0,1.27
1206 = smd 1.6 x 1.8: 1 -1.4,0; 2 1.4,0
2X10 = drill 1.016 pad 1.88 octagon: 1 -11.43,-1.27; 2 -11.43,1.27; 3 -8.89,-1.27; 4 -8.89,1.27; 5 -6.35,-1.27; 6 -6.35,1.27; 7 -3.81,-1.27; 8 -3.81,1.27; 9 -1.27,-1.27; 10 -1.27,1.27; 11 1.27,-1.27; 12 1.27,1.27; 13 3.81,-1.27; 14 3.81,1.27; 15 6.35,-1.27; 16 6.35,1.27; 17 8.89,-1.27; 18 8.89,1.27; 19 11.43,-1.27; 20 11.43,1.27
2X8 = drill 1.016 pad 1.88 octagon: 1 0,0; 2 0,2.54; 3 2.54,0; 4 2.54,2.54; 5 5.08,0; 6 5.08,2.54; 7 7.62,0; 8 7.62,2.54; 9 10.16,0; 10 10.16,2.54; 11 12.7,0; 12 12.7,2.54; 13 15.24,0; 14 15.24,2.54; 15 17.78,0; 16 17.78,2.54
SO08-EIAJ = smd 0.61 x 2.21: 1 -1.905,-3.378; 2 -0.635,-3.378; 3 0.635,-3.378; 4 1.905,-3.378; 5 1.905,3.353; 6 0.635,3.353; 7 -0.635,3.353; 8 -1.905,3.353
1008-2 = smd 1.02 x 2.54: 1 -1.145,0; 2 1.145,0
1X06 = drill 1.016 pad 1.88 round: 1 0,0; 2 2.54,0; 3 5.08,0; 4 7.62,0; 5 10.16,0; 6 12.7,0
TSSOP20 = smd 1 x 0.4: 1 -2.937,2.693; 2 -2.937,2.032; 3 -2.937,1.372; 4 -2.937,0.712; 5 -2.937,0.051; 6 -2.937,-0.609; 7 -2.937,-1.27; 8 -2.943,-1.93; 9 -2.937,-2.59; 10 -2.937,-3.251; 11 2.905,-3.251; 12 2.905,-2.59; 13 2.911,-1.93; 14 2.905,-1.27; 15 2.905,-0.609; 16 2.905,0.051; 17 2.905,0.712; 18 2.905,1.372; 19 2.905,2.032; 20 2.905,2.693
0402-RES = smd 0.7 x 0.9: 1 -0.65,0; 2 0.65,0
TACTILE_SWITCH_SMD = smd 1.524 x 0.762: 1 -2.54,1.905; 2 2.54,1.905; 3 -2.54,-1.905; 4 2.54,-1.905
EXB2HV = smd 0.38 x 0.5: 1 -1.75,-0.75; 8 1.75,-0.75; 9 1.75,0.75; 16 -1.75,0.75 | smd 0.25 x 0.5: 2 -1.25,-0.75; 3 -0.75,-0.75; 4 -0.25,-0.75; 5 0.25,-0.75; 6 0.75,-0.75; 7 1.25,-0.75; 10 1.25,0.75; 11 0.75,0.75; 12 0.25,0.75; 13 -0.25,0.75; 14 -0.75,0.75; 15 -1.25,0.75
TSOPII86 = smd 0.23 x 1.6: P$1 -9.66,-6.24; P$2 -9.16,-6.24; P$3 -8.66,-6.24; P$4 -8.16,-6.24; P$5 -7.66,-6.24; P$6 -7.16,-6.24; P$7 -6.66,-6.24; P$8 -6.16,-6.24; P$9 -5.66,-6.24; P$10 -5.16,-6.24; P$11 -4.66,-6.24; P$12 -4.16,-6.24; P$13 -3.66,-6.24; P$14 -3.16,-6.24; P$15 -2.66,-6.24; P$16 -2.16,-6.24; P$17 -1.66,-6.24; P$18 -1.16,-6.24; P$19 -0.66,-6.24; P$20 -0.16,-6.24; P$21 0.34,-6.24; P$22 0.84,-6.24; P$23 1.34,-6.24; P$24 1.84,-6.24; P$25 2.34,-6.24; P$26 2.84,-6.24; P$27 3.34,-6.24; P$28 3.84,-6.24; P$29 4.34,-6.24; P$30 4.84,-6.24; P$31 5.34,-6.24; P$32 5.84,-6.24; P$33 6.34,-6.24; P$34 6.84,-6.24; P$35 7.34,-6.24; P$36 7.84,-6.24; P$37 8.34,-6.24; P$38 8.84,-6.24; P$39 9.34,-6.24; P$40 9.84,-6.24; P$41 10.34,-6.24; P$42 10.84,-6.24; P$43 11.34,-6.24; P$44 11.34,6.26; P$45 10.84,6.26; P$46 10.34,6.26; P$47 9.84,6.26; P$48 9.34,6.26; P$49 8.84,6.26; P$50 8.34,6.26; P$51 7.84,6.26; P$52 7.34,6.26; P$53 6.84,6.26; P$54 6.34,6.26; P$55 5.84,6.26; P$56 5.34,6.26; P$57 4.84,6.26; P$58 4.34,6.26; P$59 3.84,6.26; P$60 3.34,6.26; P$61 2.84,6.26; P$62 2.34,6.26; P$63 1.84,6.26; P$64 1.34,6.26; P$65 0.84,6.26; P$66 0.34,6.26; P$67 -0.16,6.26; P$68 -0.66,6.26; P$69 -1.16,6.26; P$70 -1.66,6.26; P$71 -2.16,6.26; P$72 -2.66,6.26; P$73 -3.16,6.26; P$74 -3.66,6.26; P$75 -4.16,6.26; P$76 -4.66,6.26; P$77 -5.16,6.26; P$78 -5.66,6.26; P$79 -6.16,6.26; P$80 -6.66,6.26; P$81 -7.16,6.26; P$82 -7.66,6.26; P$83 -8.16,6.26; P$84 -8.66,6.26; P$85 -9.16,6.26; P$86 -9.66,6.26
SOT23-5 = smd 0.55 x 1.2: 1 -0.95,-1.3; 2 0,-1.3; 3 0.95,-1.3; 4 0.95,1.3; 5 -0.95,1.3
SOT23-W = smd 1.2 x 1.4: 1 -1.1,-1.3; 2 1.1,-1.3 | smd 2.8 x 1.4: 3 0,1.3
TSSOP20' = smd 0.25 x 2: P$1 -5.85,-1.1; P$2 -5.2,-1.1; P$3 -4.55,-1.1; P$4 -3.9,-1.1; P$5 -3.25,-1.1; P$6 -2.6,-1.1; P$7 -1.95,-1.1; P$8 -1.3,-1.1; P$9 -0.65,-1.1; P$10 0,-1.1; P$11 0,5.55; P$12 -0.65,5.55; P$13 -1.3,5.55; P$14 -1.95,5.55; P$15 -2.6,5.55; P$16 -3.25,5.55; P$17 -3.9,5.55; P$18 -4.55,5.55; P$19 -5.2,5.55; P$20 -5.85,5.55
PQ208 = smd 1.3 x 0.32: 1 -14.85,12.75; 2 -14.85,12.25; 3 -14.85,11.75; 4 -14.85,11.25; 5 -14.85,10.75; 6 -14.85,10.25; 7 -14.85,9.75; 8 -14.85,9.25; 9 -14.85,8.75; 10 -14.85,8.25; 11 -14.85,7.75; 12 -14.85,7.25; 13 -14.85,6.75; 14 -14.85,6.25; 15 -14.85,5.75; 16 -14.85,5.25; 17 -14.85,4.75; 18 -14.85,4.25; 19 -14.85,3.75; 20 -14.85,3.25; 21 -14.85,2.75; 22 -14.85,2.25; 23 -14.85,1.75; 24 -14.85,1.25; 25 -14.85,0.75; 26 -14.85,0.25; 27 -14.85,-0.25; 28 -14.85,-0.75; 29 -14.85,-1.25; 30 -14.85,-1.75; 31 -14.85,-2.25; 32 -14.85,-2.75; 33 -14.85,-3.25; 34 -14.85,-3.75; 35 -14.85,-4.25; 36 -14.85,-4.75; 37 -14.85,-5.25; 38 -14.85,-5.75; 39 -14.85,-6.25; 40 -14.85,-6.75; 41 -14.85,-7.25; 42 -14.85,-7.75; 43 -14.85,-8.25; 44 -14.85,-8.75; 45 -14.85,-9.25; 46 -14.85,-9.75; 47 -14.85,-10.25; 48 -14.85,-10.75; 49 -14.85,-11.25; 50 -14.85,-11.75; 51 -14.85,-12.25; 52 -14.85,-12.75; 105 14.85,-12.75; 106 14.85,-12.25; 107 14.85,-11.75; 108 14.85,-11.25; 109 14.85,-10.75; 110 14.85,-10.25; 111 14.85,-9.75; 112 14.85,-9.25; 113 14.85,-8.75; 114 14.85,-8.25; 115 14.85,-7.75; 116 14.85,-7.25; 117 14.85,-6.75; 118 14.85,-6.25; 119 14.85,-5.75; 120 14.85,-5.25; 121 14.85,-4.75; 122 14.85,-4.25; 123 14.85,-3.75; 124 14.85,-3.25; 125 14.85,-2.75; 126 14.85,-2.25; 127 14.85,-1.75; 128 14.85,-1.25; 129 14.85,-0.75; 130 14.85,-0.25; 131 14.85,0.25; 132 14.85,0.75; 133 14.85,1.25; 134 14.85,1.75; 135 14.85,2.25; 136 14.85,2.75; 137 14.85,3.25; 138 14.85,3.75; 139 14.85,4.25; 140 14.85,4.75; 141 14.85,5.25; 142 14.85,5.75; 143 14.85,6.25; 144 14.85,6.75; 145 14.85,7.25; 146 14.85,7.75; 147 14.85,8.25; 148 14.85,8.75; 149 14.85,9.25; 150 14.85,9.75; 151 14.85,10.25; 152 14.85,10.75; 153 14.85,11.25; 154 14.85,11.75; 155 14.85,12.25; 156 14.85,12.75 | smd 0.32 x 1.3: 53 -12.75,-14.85; 54 -12.25,-14.85; 55 -11.75,-14.85; 56 -11.25,-14.85; 57 -10.75,-14.85; 58 -10.25,-14.85; 59 -9.75,-14.85; 60 -9.25,-14.85; 61 -8.75,-14.85; 62 -8.25,-14.85; 63 -7.75,-14.85; 64 -7.25,-14.85; 65 -6.75,-14.85; 66 -6.25,-14.85; 67 -5.75,-14.85; 68 -5.25,-14.85; 69 -4.75,-14.85; 70 -4.25,-14.85; 71 -3.75,-14.85; 72 -3.25,-14.85; 73 -2.75,-14.85; 74 -2.25,-14.85; 75 -1.75,-14.85; 76 -1.25,-14.85; 77 -0.75,-14.85; 78 -0.25,-14.85; 79 0.25,-14.85; 80 0.75,-14.85; 81 1.25,-14.85; 82 1.75,-14.85; 83 2.25,-14.85; 84 2.75,-14.85; 85 3.25,-14.85; 86 3.75,-14.85; 87 4.25,-14.85; 88 4.75,-14.85; 89 5.25,-14.85; 90 5.75,-14.85; 91 6.25,-14.85; 92 6.75,-14.85; 93 7.25,-14.85; 94 7.75,-14.85; 95 8.25,-14.85; 96 8.75,-14.85; 97 9.25,-14.85; 98 9.75,-14.85; 99 10.25,-14.85; 100 10.75,-14.85; 101 11.25,-14.85; 102 11.75,-14.85; 103 12.25,-14.85; 104 12.75,-14.85; 157 12.75,14.85; 158 12.25,14.85; 159 11.75,14.85; 160 11.25,14.85; 161 10.75,14.85; 162 10.25,14.85; 163 9.75,14.85; 164 9.25,14.85; 165 8.75,14.85; 166 8.25,14.85; 167 7.75,14.85; 168 7.25,14.85; 169 6.75,14.85; 170 6.25,14.85; 171 5.75,14.85; 172 5.25,14.85; 173 4.75,14.85; 174 4.25,14.85; 175 3.75,14.85; 176 3.25,14.85; 177 2.75,14.85; 178 2.25,14.85; 179 1.75,14.85; 180 1.25,14.85; 181 0.75,14.85; 182 0.25,14.85; 183 -0.25,14.85; 184 -0.75,14.85; 185 -1.25,14.85; 186 -1.75,14.85; 187 -2.25,14.85; 188 -2.75,14.85; 189 -3.25,14.85; 190 -3.75,14.85; 191 -4.25,14.85; 192 -4.75,14.85; 193 -5.25,14.85; 194 -5.75,14.85; 195 -6.25,14.85; 196 -6.75,14.85; 197 -7.25,14.85; 198 -7.75,14.85; 199 -8.25,14.85; 200 -8.75,14.85; 201 -9.25,14.85; 202 -9.75,14.85; 203 -10.25,14.85; 204 -10.75,14.85; 205 -11.25,14.85; 206 -11.75,14.85; 207 -12.25,14.85; 208 -12.75,14.85

### Placement (x,y rotation side)
1V2_C1  24.13,50.16 90 top
1V2_C2  27.3,51.44 180 top
1V2_C3  27.3,54.61 0 top
1V8_C1  17.14,50.16 90 top
1V8_C2  20.32,51.44 180 top
1V8_C3  20.32,54.61 0 top
2V5_C1  10.16,50.16 90 top
2V5_C2  13.34,51.44 180 top
2V5_C3  13.34,54.61 0 top
3V3_C1  3.17,50.16 90 top
3V3_C2  6.35,51.44 180 top
3V3_C3  6.35,54.61 0 top
5V  31.75,58.42 90 top
5V_C1  33.66,52.7 90 top
5V_C2  30.48,52.7 90 top
AUX_C1  63.5,38.1 0 top
AUX_C2  30.48,8.26 180 top
AUX_C3  27.3,13.97 0 top
AUX_C4  35,5.27 90 top
AUX_C5  27.3,30.48 0 top
AUX_C6  56.52,41.27 270 top
AUX_C7  66.67,29.84 180 top
AUX_C8  27.3,20.32 0 top
CAMERA_R  82.55,5.08 180 top
CORE_C1  30.48,38.1 180 top
CORE_C2  63.5,8.26 0 top
CORE_C3  27.3,27.94 0 top
CORE_C4  66.67,16.51 0 top
CORE_C5  53.34,41.27 90 top
CORE_C6  42,5.27 270 top
DATA  38.73,54.61 0 top
FLASH  64.77,3.81 270 top
FLASH_C1  67.11,8.17 270 top
I1  3.17,58.42 0 top
I2  10.16,58.42 0 top
I3  24.13,58.42 0 top
I4  17.14,58.42 0 top
INFO1  -836.22,826.47 0 top  (outside the outline)
JTAG  80.01,57.15 0 top
PROM  86.77,47.73 0 top
R1  78.45,53.69 270 top
R2  84.26,53.69 270 top
R3  87.88,53.69 270 top
R6  27.3,10.79 180 top
R7  27.3,35.56 180 top
R8  59.69,41.27 270 top
R9  23.5,27.3 0 top
R10  27.3,22.86 180 top
R11  66.67,23.5 0 top
R12  66.67,19.68 0 top
RAM_C1  34.34,16.48 270 bottom
RAM_C2  34.29,23.4 90 bottom
RAM_C3  34.69,30.3 270 bottom
RAM_C4  35,34.27 270 bottom
RAM_C5  59,34.27 270 bottom
RAM_C6  60.33,30.48 90 bottom
RAM_C7  59,12.27 90 bottom
RAM_C8  59.69,16.51 270 bottom
RAM_C9  60.33,20.32 270 bottom
RAM_C10  60.33,25.4 270 bottom
RAM_C11  35,12.27 270 bottom
RAM_C12  51.44,4.32 270 top
RESE  73.66,57.15 0 top
RN1  50,13.27 180 bottom
RN2  55,13.27 180 bottom
RN3  49,34.27 180 bottom
RN4  54,34.27 180 bottom
RN5  44,34.27 180 bottom
RN6  38,34.27 180 bottom
RN7  40,13.27 180 bottom
RN8  45,13.27 180 bottom
SDRAM  46.35,22.86 180 bottom
STEPDOWN_1V2  24.13,53.98 0 top
STEPDOWN_1V8  17.14,53.98 0 top
STEPDOWN_2V5  10.16,53.98 0 top
STEPDOWN_3V3  3.17,53.98 0 top
SUP_C1  90.81,40.01 180 top
SUPERVISOR  87,41.27 0 top
TRANS_C1  66.67,42.55 180 top
TRANS_C2  66.67,45.72 180 top
TRANS_C4  27.94,45.72 180 top
TRANSC3  27.94,42.55 0 top
TRANSLATOR_2  [TSSOP20']  31.11,46.35 180 bottom
TRANSLATOR_4  [TSSOP20']  68.58,46.35 180 bottom
U$1  47,23.27 270 top
U$4  13.97,5.08 0 top
VCC0_C1  71.24,22.04 0 top
VCC0_C2  66.67,33.02 180 top
VCC0_C3  66.67,26.67 180 top
VCC0_C4  66.67,13.34 180 top
VCC1_C1  46.99,4.45 270 top
VCC1_C2  39,5.27 90 top
VCC1_C3  57.78,4.32 90 top
VCC1_C4  54.61,4.32 90 top
VCC2_C1  23.07,23.58 180 top
VCC2_C2  27.3,17.14 180 top
VCC2_C3  27.3,33.02 180 top
VCC2_C4  27.3,25.4 180 top
VCC3_C1  46.99,42.55 90 top
VCC3_C2  37.47,41.27 90 top
VCC3_C3  50.16,41.27 90 top
VCC3_C4  41.27,41.27 90 top

### Tracks (layer width: path | path; a pad name or v marks a point on that pad's centre or on a via)
1.2V  (11 unrouted)
  Top 0.305: CORE_C4.1 65.27,17.02 U$1.170 61.11,17.02 | CORE_C5.1 53.75,39.97 U$1.13 | CORE_C6.1 41.46,6.71 40.54,6.71 40.25,6.99 U$1.117
1.8V  (7 unrouted)
2.5V  (via drill 0.5)  (15 unrouted)
  Top 0.305: U$1.92 30.83,16.52 v30.28,17.07 | AUX_C7.2 65.45,29.52 U$1.195 60.3,29.52 59.74,28.96 59.74,15.54 60.27,15.02 U$1.166 | v25.3,13.41 25.45,13.41 25.76,13.11 27.74,13.11 28.2,13.57 AUX_C3.2 | U$1.66 29.92,29.52 29.11,30.33 28.36,30.33 AUX_C5.2 | U$1.7 56.75,40.14 AUX_C6.2 57.29,41.15 58.22,41.15 59.24,42.17 R8.1 61.63,40.23 63.86,40.23 64.9,39.19 AUX_C1.2 | AUX_C4.2 35.08,6.25 36.12,6.25 37.25,7.38 U$1.111
  Bottom 0.305: v30.28,17.07 30.28,15.04 28.5,13.26 25.45,13.26 v25.3,13.41
3.3V  (via drill 0.5)  (46 unrouted)
  Top 0.305: 31.7,18.49 32.12,18.49 U$1.88 31.47,18.52 v30.28,19.71 | U$4.1 3.86,5.13 3.86,7.32 4.47,7.92 5.69,7.92 6.5,8.74 7.52,8.74 9.96,11.18 11.99,11.18 13.21,12.39 14.22,12.39 19.3,17.48 19.3,27.23 20.73,28.65 23.98,28.65 24.39,28.23 R9.2 24.39,23.66 VCC2_C1.1 25.19,22.86 R10.2 28.2,24.66 VCC2_C4.1 28.2,26.38 28.45,26.62 28.65,26.62 29.67,27.64 v30.07,27.64 30.66,27.64 30.95,27.35 30.95,26.35 31,26.3 | 31.29,26.01 U$1.73 31.3,26.02 31.29,26.01 | VCC2_C2.1 28.28,17.07 29.26,17.07 | 31,26.3 31.29,26.01 | 31,26.3 31,27.3 30.65,27.65 v30.05,27.65 | U$1.201 62.99,32.51 63.5,33.02 VCC0_C2.2 | U$1.191 64.92,27.52 VCC0_C3.2 65.78,25.05 66.24,24.59 67.26,24.59 67.46,24.38 67.46,23.61 R11.2 69.03,22.04 VCC0_C1.1 69.84,21.95 R12.2 | VCC0_C4.2 63.8,15.3 v63.8,16.05 | v63.8,18.9 63.8,19.71 63.49,20.02 U$1.176 | VCC2_C3.1 U$1.59 | U$1.46 37.25,40.16 VCC3_C2.1 VCC3_C4.1 | VCC3_C4.1 41.25,40.35 U$1.38 | VCC3_C4.1 41.29,40.39 46.23,40.39 VCC3_C1.1 47.76,40.38 VCC3_C3.1 49.75,39.96 U$1.21 | U$1.114 38.75,6.42 VCC1_C2.2 39.84,5.33 42.67,5.33 43.74,6.4 44.81,6.4 | 44.81,6.4 46.43,6.4 VCC1_C1.1 47.09,5.94 48.46,5.94 49.19,5.22 RAM_C12.1 VCC1_C4.2 | 44.81,6.4 44.25,6.96 U$1.125 | VCC1_C4.2 VCC1_C3.2 | VCC1_C4.2 53.25,6.58 U$1.143
  Bottom 0.305: v30.05,27.65 31.09,26.61 31.09,23.37 31.5,22.96 31.5,22.15 29.26,19.91 29.26,18.69 | 29.26,18.69 29.26,17.07 | 29.26,18.69 v30.28,19.71 | v63.8,16.05 v63.8,18.9
5V  (14 unrouted)
A0  (1 unrouted)
A1  (1 unrouted)
A2  (1 unrouted)
A3  (via drill 0.5)
  Top 0.203: v49.53,10.21 49.07,10.21 48.25,9.39 U$1.133
  Bottom 0.203: RN1.13 49.75,10.43 v49.53,10.21
A4  (via drill 0.5)
  Top 0.203: v48.92,10.97 48.62,10.36 47.7,9.45 47.7,8.47 U$1.132
  Bottom 0.203: RN1.14 49.23,12.49 49.23,11.28 v48.92,10.97
A5  (via drill 0.5)
  Top 0.203: v47.4,10.21 46.63,10.21 46.25,9.83 U$1.129
  Bottom 0.203: RN1.15 48.75,11.72 48.16,11.12 48.16,10.97 v47.4,10.21
A6  (via drill 0.5)
  Top 0.203: v46.79,11.12 45.75,10.09 U$1.128
  Bottom 0.203: RN1.16 48.25,11.98 47.85,11.58 47.24,11.58 v46.79,11.12
A7  (1 unrouted)
A8  (1 unrouted)
A9  (1 unrouted)
A10  (1 unrouted)
BA0  (1 unrouted)
BA1  (1 unrouted)
CAS  (1 unrouted)
CKE  (1 unrouted)
CLK  (1 unrouted)
CS  (1 unrouted)
D1  (via drill 0.5)
  Top 0.305: U$1.55 31.12,35.02 30.63,35.51 30.63,42.37 v31.39,43.13
  Bottom 0.305: v31.39,43.13 31.11,42.85 TRANSLATOR_2.P$11
D2  (1 unrouted)
D3  (1 unrouted)
  Top 0.305: U$1.60 29.17,32.52 28.65,32 25.76,32
D4  (1 unrouted)
  Top 0.305: U$1.61 29.43,32.02 28.96,31.55 25.76,31.55
D5  (1 unrouted)
  Top 0.305: U$1.62 33.5,31.52 33.83,31.85 33.83,32.31
D6  (1 unrouted)
  Top 0.305: U$1.63 34.52,31.02 34.9,31.39 34.9,32.31
D7  (1 unrouted)
  Top 0.305: U$1.64 31.2,30.52 30.63,31.09 29.87,31.09 29.72,31.24
D8  (1 unrouted)
  Top 0.305: U$1.65 30.64,30.02 30.33,30.33
D9  (1 unrouted)
D10  (1 unrouted)
D11  (1 unrouted)
D12  (1 unrouted)
D13  (1 unrouted)
D14  (1 unrouted)
D15  (1 unrouted)
D16  (1 unrouted)
DQ0  (1 unrouted)
DQ1  (1 unrouted)
DQ2  (1 unrouted)
DQ3  (1 unrouted)
DQ4  (1 unrouted)
DQ5  (1 unrouted)
DQ6  (1 unrouted)
DQ7  (1 unrouted)
DQ8  (1 unrouted)
DQ9  (1 unrouted)
DQ10  (1 unrouted)
DQ11  (1 unrouted)
DQ12  (1 unrouted)
DQ13  (1 unrouted)
DQ14  (1 unrouted)
DQ15  (1 unrouted)
DQ16  (1 unrouted)
DQ17  (1 unrouted)
DQ18  (1 unrouted)
DQ19  (1 unrouted)
DQ20  (1 unrouted)
DQ21  (1 unrouted)
DQ22  (1 unrouted)
DQ23  (1 unrouted)
DQ24  (1 unrouted)
DQ25  (1 unrouted)
DQ26  (1 unrouted)
DQ27  (via drill 0.5)
  Top 0.203: v53.34,10.06 52.27,10.06 51.82,9.6 51.82,8.49 U$1.140
  Bottom 0.203: RN2.14 54.25,10.97 v53.34,10.06
DQ28  (via drill 0.5)
  Top 0.203: v53.49,11.43 52.73,11.28 51.21,9.75 51.21,8.46 U$1.139
  Bottom 0.203: RN2.15 53.75,11.84 v53.49,11.43
DQ29  (via drill 0.5)
  Top 0.203: v52.43,11.89 50.75,10.21 U$1.138
  Bottom 0.203: RN2.16 52.62,11.89 v52.43,11.89
DQ30  (1 unrouted)
DQ31  (1 unrouted)
DQM0  (1 unrouted)
DQM1  (1 unrouted)
DQM2  (1 unrouted)
DQM3  (via drill 0.5)
  Top 0.203: v50.55,11.17 50.25,9.86 49.84,9.45 48.92,9.45 48.77,9.3 48.77,8.44 U$1.134
  Bottom 0.203: 50.6,10.97 v50.55,11.17 50.25,11.47 RN1.12
GND  (55 unrouted)
  pour Top (isolate 0.406): 0,48.26 0,60.96 35.56,60.96 35.56,48.26
  pour Top (isolate 0.406): 0,47.62 36.2,47.62 36.2,60.96 96.52,60.96 96.52,0 0,0
  pour Bottom (isolate 0.406): 0,48.26 35.56,48.26 35.56,60.96 0,60.96
L1  (1 unrouted)
  Top 0.305: U$4.4 6.86,8.13 8.13,8.13 10.16,10.16 11.99,10.16 13.41,11.58 14.22,11.58 19.91,17.27 19.91,26.42 20.8,27.3 R9.1
L2  (via drill 0.5)
  Top 0.305: U$1.76 29.4,24.52 v29.26,24.38 | v22.15,18.49 21.74,18.09 21.74,16.66 14.83,9.75 14.02,9.75 12.6,8.33 11.79,8.33 10.16,6.71 U$4.8
  Bottom 0.305: v29.26,24.38 28.45,24.38 22.55,18.49 v22.15,18.49
L3  (via drill 0.5)
  Top 0.305: U$1.75 30.05,25.02 v29.46,25.6 | v21.54,19.3 21.13,18.9 21.13,16.87 14.63,10.36 13.82,10.36 12.39,8.94 11.58,8.94 10.36,7.72 9.55,7.72 8.94,7.11 8.94,5.13 U$4.5
  Bottom 0.305: v29.46,25.6 28.85,25.6 23.37,20.12 22.35,20.12 v21.54,19.3
L5  (via drill 0.5)
  Top 0.305: v23.77,17.48 23.37,17.07 23.37,16.66 15.24,8.53 14.43,8.53 12.7,6.81 U$4.10 | v30.48,22.35 30.48,23.01 30.99,23.52 U$1.78
  Bottom 0.305: v30.48,22.35 28.04,22.35 23.77,18.09 v23.77,17.48
L6  (via drill 0.5)
  Top 0.305: U$1.74 30.97,25.52 v30.07,26.42 | v21.13,20.52 20.52,19.91 20.52,17.07 14.43,10.97 13.61,10.97 12.19,9.55 10.57,9.55 7.62,6.6 U$4.6
  Bottom 0.305: v30.07,26.42 28.85,26.42 23.16,20.73 21.34,20.73 v21.13,20.52
L7
  Top 0.305: U$1.83 29.96,21.02 29.26,20.32 29.26,19.71 28.95,19.4 26.11,19.4 24.79,18.09 24.79,17.27 15.44,7.92 14.63,7.92 13.95,7.24 13.95,5.06 U$4.9
L8  (via drill 0.5)
  Top 0.305: U$1.77 32.11,23.98 30.28,23.98 v29.67,23.37 | v22.76,17.48 22.35,17.07 22.35,16.46 15.04,9.14 14.22,9.14 12.8,7.72 12.19,7.72 11.4,6.93 11.4,5.05 U$4.7
  Bottom 0.305: v29.67,23.37 28.25,23.37 22.96,18.09 v22.76,17.48
L9
  Top 0.305: U$1.90 31.05,17.52 30.68,17.88 29.26,17.88 28.85,18.29 27.64,18.29 27.43,18.09 27.43,16.46 27.12,16.15 25.29,16.15 16.55,7.41 16.55,5.12 U$4.11
L10  (via drill 0.5)
  Top 0.305: U$1.82 29.89,21.52 29.57,21.84 | 29.57,21.84 28.55,22.86 R10.1 | v29.06,21.34 29.57,21.84
  Bottom 0.305: U$4.3 5.08,4.47 6.35,5.74 6.35,7.95 7.14,8.74 12.8,8.74 20.32,16.26 24.18,16.26 29.06,21.13 v29.06,21.34
L11
  Top 0.305: U$1.94 29.34,15.52 28.85,15.04 25.81,15.04 19.1,8.33 19.1,5.49 17.78,4.17 U$4.13
L12
  Top 0.305: U$1.89 31.36,18.02 30.89,18.49 29.46,18.49 29.06,18.9 26.42,18.9 25.4,17.88 25.4,17.07 15.24,6.91 U$4.12
L13
  Top 0.305: U$1.97 29.87,14.02 29.46,13.61 29.46,12.39 29.06,11.99 26.01,11.99 24.99,10.97 24.99,8.33 24.18,7.52 24.18,5.28 23.98,5.08 22.35,5.08 21.08,3.81 U$4.15
L14  (1 unrouted)
  Top 0.305: U$1.93 28.36,16.02 27.94,15.6 25.55,15.6 17.78,7.83 U$4.14
L15
  Top 0.305: U$4.20 25.4,7.52 27.64,9.75 28.65,9.75 29.87,10.97 29.87,12.19 30.68,13.01 32.13,13.01 U$1.99
L16
  Top 0.305: U$1.96 29.56,14.52 28.95,13.91 28.95,13.1 28.45,12.6 25.61,12.6 20.52,7.52 20.52,6.55 U$4.16
L17
  Top 0.254: U$4.19 27.94,3.81 30.48,6.35 30.48,11.03 30.97,11.52 U$1.102
N$1  (1 unrouted)
N$2
  Bottom 0.203: RN1.1 48.2,14.07 SDRAM.P$63
N$3  (1 unrouted)
N$4
  Bottom 0.203: RN1.2 48.7,14.07 SDRAM.P$62
N$5
  pour Bottom: 0,48.26 0,0 96.52,0 96.52,60.96 36.2,60.96 36.2,47.62 0.64,47.62 0.64,46.99
N$6  (via drill 0.5)
  other vias: 29.26,17.07
N$7
  Bottom 0.203: RN1.3 49.2,14.07 SDRAM.P$61
N$8
  Bottom 0.203: RN1.4 49.7,14.07 SDRAM.P$60
N$9
  Bottom 0.203: RN1.5 50.2,14.07 SDRAM.P$59
N$10
  Bottom 0.203: RN1.6 50.75,15.09 51.2,15.53 SDRAM.P$57
N$11
  Bottom 0.203: RN1.7 51.36,14.13 51.36,14.78 51.7,15.12 SDRAM.P$56
N$12
  Bottom 0.203: RN1.8 52.7,14.96 SDRAM.P$54
N$13
  Bottom 0.203: RN2.1 53.2,14.07 SDRAM.P$53
N$14
  Bottom 0.203: RN2.2 53.8,14.07 53.8,15.39 54.2,15.79 SDRAM.P$51
N$15
  Bottom 0.203: RN2.3 54.41,14.18 54.41,15.39 54.7,15.68 SDRAM.P$50
N$16
  Bottom 0.203: RN2.4 54.86,14.13 54.86,14.94 55.7,15.77 SDRAM.P$48
N$17
  Bottom 0.203: RN2.5 55.32,14.09 55.32,14.94 56.2,15.81 SDRAM.P$47
N$18
  Bottom 0.203: RN2.6 55.78,14.05 55.78,14.78 56.08,15.09 56.54,15.09 57.2,15.74 SDRAM.P$45
N$19
  Bottom 0.203: SDRAM.P$22 47.25,29.16 RN3.16
N$20
  Bottom 0.203: SDRAM.P$23 47.75,29.16 RN3.15
N$21
  Bottom 0.203: SDRAM.P$24 48.25,29.16 RN3.14
N$22
  Bottom 0.203: SDRAM.P$25 48.75,29.16 RN3.13
N$23
  Bottom 0.203: SDRAM.P$26 49.25,29.16 RN3.12
N$24
  Bottom 0.203: SDRAM.P$28 50.25,29.16 RN3.10
N$25
  Bottom 0.203: SDRAM.P$27 49.75,29.16 RN3.11
N$26
  Bottom 0.203: SDRAM.P$30 51.21,29.11 51.21,30.18 50.75,30.63 RN3.9
N$27
  Bottom 0.203: SDRAM.P$31 51.66,29.13 51.66,32.93 RN4.16
N$28
  Bottom 0.203: RN4.15 52.75,29.16 SDRAM.P$33
N$29
  Bottom 0.203: SDRAM.P$34 53.2,33.47 RN4.14
N$30  (via drill 0.5)
  other vias: 30.28,17.07
N$31  (via drill 0.5)
  other vias: 30.07,26.42
N$32
  Bottom 0.203: RN4.13 53.75,30.83 54.2,30.39 SDRAM.P$36
N$33
  Bottom 0.203: RN4.12 54.25,31.09 54.7,30.65 SDRAM.P$37
N$34  (1 unrouted)
N$35  (4 unrouted)
  Top 0.305: R7.1 28.3,35.56 29.34,34.52 U$1.56
N$36  (1 unrouted)
N$37  (1 unrouted)
N$38  (1 unrouted)
N$39
  Bottom 0.203: RN4.11 54.75,31.36 55.7,30.41 SDRAM.P$39
N$40
  Bottom 0.203: RN4.10 55.25,31.47 56.2,30.52 SDRAM.P$40
N$41
  Bottom 0.203: RN5.9 45.72,33.49 45.72,32.16 46.2,31.68 SDRAM.P$20
N$42
  Bottom 0.203: RN5.10 45.26,33.51 45.26,31.85 45.7,31.42 SDRAM.P$19
N$43
  Bottom 0.203: RN5.11 44.75,31.6 45.2,31.16 SDRAM.P$18
N$44
  Bottom 0.203: RN5.12 44.2,33.47 44.2,31.24 44.7,30.74 SDRAM.P$17
N$45
  Bottom 0.203: RN5.13 43.75,30.62 44.2,30.18 SDRAM.P$16
N$46
  Bottom 0.203: RN5.14 43.25,29.1 SDRAM.P$14
N$47
  Bottom 0.203: RN5.15 42.75,29.1 SDRAM.P$13
N$48
  Bottom 0.203: RN5.16 41.7,32.97 SDRAM.P$11
N$49
  Bottom 0.203: RN6.9 39.78,33.49 39.78,32.16 41.2,30.74 SDRAM.P$10
N$50
  Bottom 0.203: RN6.10 39.32,33.45 39.32,32 40.2,31.13 SDRAM.P$8
N$51
  Bottom 0.203: RN6.11 38.71,33.48 38.71,31.85 39.7,30.87 SDRAM.P$7
N$52
  Bottom 0.203: RN6.12 38.25,31.09 38.7,30.65 SDRAM.P$5
N$53
  Bottom 0.203: RN6.13 37.75,30.52 38.2,30.08 SDRAM.P$4
N$54
  Bottom 0.203: RN6.14 37.2,33.47 SDRAM.P$2
N$55
  Bottom 0.203: RN7.1 37.2,15.07 SDRAM.P$85
N$56
  Bottom 0.203: RN7.2 38.71,14.06 38.71,14.48 38.2,14.99 SDRAM.P$83
N$57
  Bottom 0.203: RN7.3 39.17,14.1 39.17,14.48 38.7,14.95 SDRAM.P$82
N$58
  Bottom 0.203: RN7.4 39.7,14.07 SDRAM.P$80
N$59
  Bottom 0.203: RN7.5 40.2,14.07 SDRAM.P$79
N$60
  Bottom 0.203: RN7.6 40.84,14.11 40.84,14.78 41.2,15.13 SDRAM.P$77
N$61
  Bottom 0.203: RN7.7 41.3,14.07 41.3,14.48 41.7,14.87 SDRAM.P$76
N$62
  Bottom 0.203: RN7.8 42.7,14.96 SDRAM.P$74
N$63
  Bottom 0.203: RN8.1 43.28,14.05 43.28,14.78 44.2,15.7 SDRAM.P$71
N$64
  Bottom 0.203: RN8.2 43.75,14.49 44.35,15.24 45.11,15.24 45.7,15.82 SDRAM.P$68
N$65
  Bottom 0.203: RN8.3 44.25,14.53 44.5,14.78 45.26,14.78 45.87,15.39 46.02,15.39 46.18,15.54 46.18,16.6 SDRAM.P$67
N$66
  Bottom 0.203: RN8.4 44.75,14.27 44.96,14.48 45.87,14.48 46.7,15.3 SDRAM.P$66
N$67  (1 unrouted)
N$68  (1 unrouted)
N$69  (1 unrouted)
N$70  (1 unrouted)
N$71  (1 unrouted)
N$72  (via drill 0.5)
  other vias: 22.15,18.49
N$73  (1 unrouted)
N$74  (1 unrouted)
N$75  (1 unrouted)
N$76  (via drill 0.5)
  other vias: 29.06,21.34
N$77  (via drill 0.5)
  other vias: 63.8,18.9
N$78  (via drill 0.5)
  other vias: 47.55,12.65
N$80  (via drill 0.5)
  other vias: 47.09,14.78
N$81  (via drill 0.5)
  other vias: 52.43,11.89
N$82  (via drill 0.5)
  other vias: 25.3,13.41
N$83  (via drill 0.5)
  other vias: 30.33,30.33
N$84  (via drill 0.5)
  other vias: 46.79,11.13
N$85  (via drill 0.5)
  other vias: 47.4,10.21
N$88  (via drill 0.5)
  other vias: 49.53,10.21
N$89  (via drill 0.5)
  other vias: 29.72,31.24
N$91  (via drill 0.5)
  other vias: 33.83,32.31
N$92  (via drill 0.5)
  other vias: 34.9,32.31
N$95  (via drill 0.5)
  Top 0.203: v47.09,14.78 47.55,14.33 v47.55,12.65
  Bottom 0.203: RN8.5 45.26,14.01 45.26,13.56 45.77,13.01 47.14,13.01 v47.55,12.65 | 47.24,16.55 SDRAM.P$65 47.2,15.29 47.09,15.19 v47.09,14.78
N$101
  Bottom 0.203: RN8.6 45.8,13.59 45.92,13.41 47.6,13.41 47.7,13.56 SDRAM.P$64
N$102
  Bottom 0.203: RN4.9 57.2,32.08 SDRAM.P$42
N$122  (2 unrouted)
N$123  (1 unrouted)
N$124  (1 unrouted)
N$125  (2 unrouted)
N$126  (3 unrouted)
N$127  (3 unrouted)
N$175  (1 unrouted)
R1  (1 unrouted)
  Top 0.305: U$1.190 64.42,27.02 64.82,26.62 64.82,24.45 R11.1
R3  (via drill 0.5)  (1 unrouted)
  Top 0.305: U$1.186 63.63,25.02 v64.01,25.4
R4  (via drill 0.5)  (1 unrouted)
  Top 0.305: U$1.185 63.67,24.52 v64.01,24.18
R5  (via drill 0.5)  (1 unrouted)
  Top 0.305: U$1.181 63.77,22.52 v64.41,23.16
R6  (via drill 0.5)  (1 unrouted)
  Top 0.305: U$1.180 64.89,22.02 v65.02,22.15
R7  (via drill 0.5)  (1 unrouted)
  Top 0.305: U$1.178 65.11,21.02 v65.23,21.13
R8  (via drill 0.5)  (1 unrouted)
  Top 0.305: U$1.177 64.22,20.52 v64.62,20.12
R9  (1 unrouted)
R10  (1 unrouted)
R11  (1 unrouted)
  Top 0.305: R12.1 65.78,19.04 64.76,18.02 U$1.172
R12
  Top 0.305: U$1.164 63.4,14.02 66.04,11.38 67.87,11.38 69.09,10.16 74.93,10.16 CAMERA_R.13
R13  (1 unrouted)
R14
  Top 0.305: U$1.162 61.87,13.01 63.6,13.01 65.84,10.77 67.67,10.77 68.89,9.55 74.17,9.55 76.2,7.52 CAMERA_R.15
R15  (1 unrouted)
R16
  Top 0.305: U$1.160 61.88,11.99 63.8,11.99 65.63,10.16 67.46,10.16 69.7,7.92 69.7,3.05 70.51,2.23 74.37,2.23 75.95,3.81 CAMERA_R.16
R17  (1 unrouted)
RAS  (1 unrouted)
T2A2  (1 unrouted)
T2A3  (1 unrouted)
T2A4  (1 unrouted)
T2A5  (1 unrouted)
T2A6  (1 unrouted)
T2A7  (1 unrouted)
T2OE  (1 unrouted)
T2VCCA  (1 unrouted)
T4A2  (1 unrouted)
T4A3  (1 unrouted)
T4A4  (1 unrouted)
T4A5  (1 unrouted)
T4A6  (1 unrouted)
T4A7
  Bottom 0.305: TRANSLATOR_4.P$8 67.28,52.81 65.48,54.61 DATA.15
T4OE
  Bottom 0.305: TRANSLATOR_4.P$10 68.58,53.34 64.77,57.15 DATA.16
T4VCCA  (1 unrouted)
WE  (1 unrouted)

### Text on the board
tPlace: GND
_tsilk: Power | JTAG